# EAGLE design JW24A10L_revE (EAGLE 6.1)
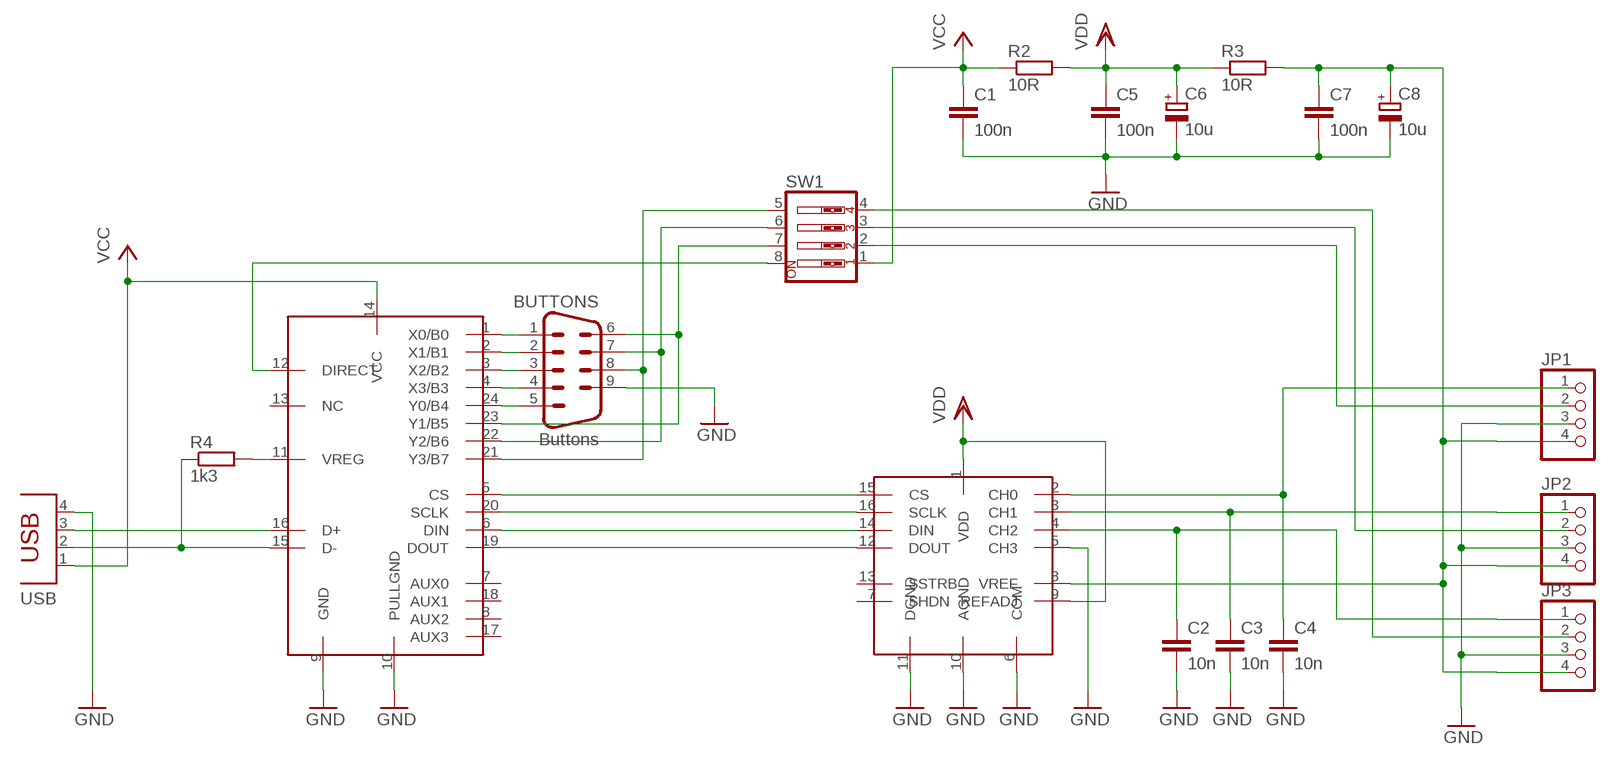
[diagram p0: schematic, sheet 1]

## Parts
BUTTONS  Buttons  M09H  [M09H]
C1  100n  C-EU025-025X050  [C025-025X050]
C2  10n  C-EU025-025X050  [C025-025X050]
C3  10n  C-EU025-025X050  [C025-025X050]
C4  10n  C-EU025-025X050  [C025-025X050]
C5  100n  C-EU025-025X050  [C025-025X050]
C6  10u  CPOL-EUE2-5  [E2-5]
C7  100n  C-EU025-025X050  [C025-025X050]
C8  10u  CPOL-EUE2-5  [E2-5]
JP1  PINHD-1X4  [1X04]
JP2  PINHD-1X4  [1X04]
JP3  PINHD-1X4  [1X04]
R2  10R  R-EU_0207/2V  [0207/2V]
R3  10R  R-EU_0207/2V  [0207/2V]
R4  1k3  R-EU_0207/2V  [0207/2V]
SW1  SW_DIP-4  [EDG-04]
U$1  MAX1249  [DIL16]
U$2  JW24A10L  [DIL24-3]
USB  PN61729  [PN61729]

## Nets
CH0: C4.1 JP1.1 U$1.2(CH0)
CH1: C3.1 JP2.1 U$1.3(CH1)
CH2: C2.1 JP3.1 U$1.4(CH2)
CH+: C7.1 C8.+ JP1.4 JP2.4 JP3.4 R3.2 U$1.8(VREF)
D+: U$2.16(D+) USB.3
D-: R4.1 U$2.15(D-) USB.2
GND: BUTTONS.9 C1.2 C2.2 C3.2 C4.2 C5.2 C6.- C7.2 C8.- JP1.3 JP2.3 JP3.3 U$1.5(CH3) U$1.6(COM) U$1.10(AGND) U$1.11(DGND) U$2.9(GND) U$2.10(PULLGND) USB.4
N$1: U$1.15(CS) U$2.5(CS)
N$2: U$1.16(SCLK) U$2.20(SCLK)
N$3: U$1.14(DIN) U$2.6(DIN)
N$4: U$1.12(DOUT) U$2.19(DOUT)
N$7: BUTTONS.1 U$2.1(X0/B0)
N$9: R4.2 U$2.11(VREG)
N$12: BUTTONS.2 U$2.2(X1/B1)
N$13: BUTTONS.3 U$2.3(X2/B2)
N$14: BUTTONS.4 U$2.4(X3/B3)
N$15: BUTTONS.5 U$2.24(Y0/B4)
N$16: BUTTONS.6 SW1.7 U$2.23(Y1/B5)
N$17: BUTTONS.7 SW1.6 U$2.22(Y2/B6)
N$18: BUTTONS.8 SW1.5 U$2.21(Y3/B7)
N$19: SW1.8 U$2.12(DIRECT)
STECK0: JP1.2 SW1.2
STECK1: JP2.2 SW1.3
STECK2: JP3.2 SW1.4
VCC: C1.1 R2.1 SW1.1 U$2.14(VCC) USB.1
VDD: C5.1 C6.+ R2.2 R3.1 U$1.1(VDD) U$1.9(REFADJ)
Unconnected: U$1.7(SHDN) U$1.13(SSTRB) U$2.7(AUX0) U$2.8(AUX2) U$2.13(NC) U$2.17(AUX3) U$2.18(AUX1)

## Library data of the parts
BUTTONS = con-subd:M09: SUB-D; OC_FARNELL: unknown; OC_NEWARK: unknown
C1-C5 C7 = rcl:C-EU: CAPACITOR, European symbol
C6 C8 = rcl:CPOL-EU: POLARIZED CAPACITOR, European symbol
JP1-JP3 = pinhead:PINHD-1X4: PIN HEADER
R2-R4 = rcl:R-EU_: RESISTOR, European symbol
SW1 = special:SW_DIP-4: DIP SWITCH
U$1 = eigene:MAX1249
U$2 = eigene:JW24A10L
USB = con-berg:PN61729: BERG USB connector; OC_FARNELL: unknown; OC_NEWARK: unknown

## Board
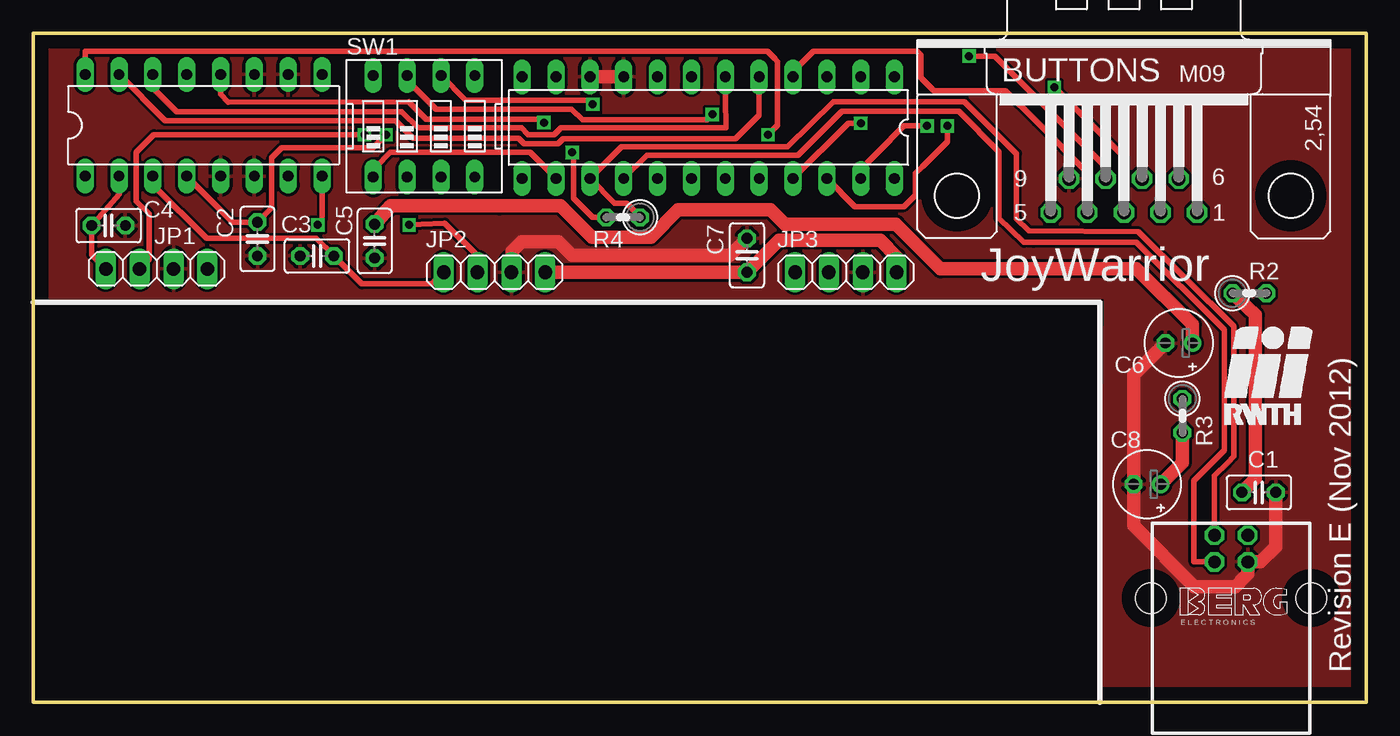
[diagram p1: board, top side]
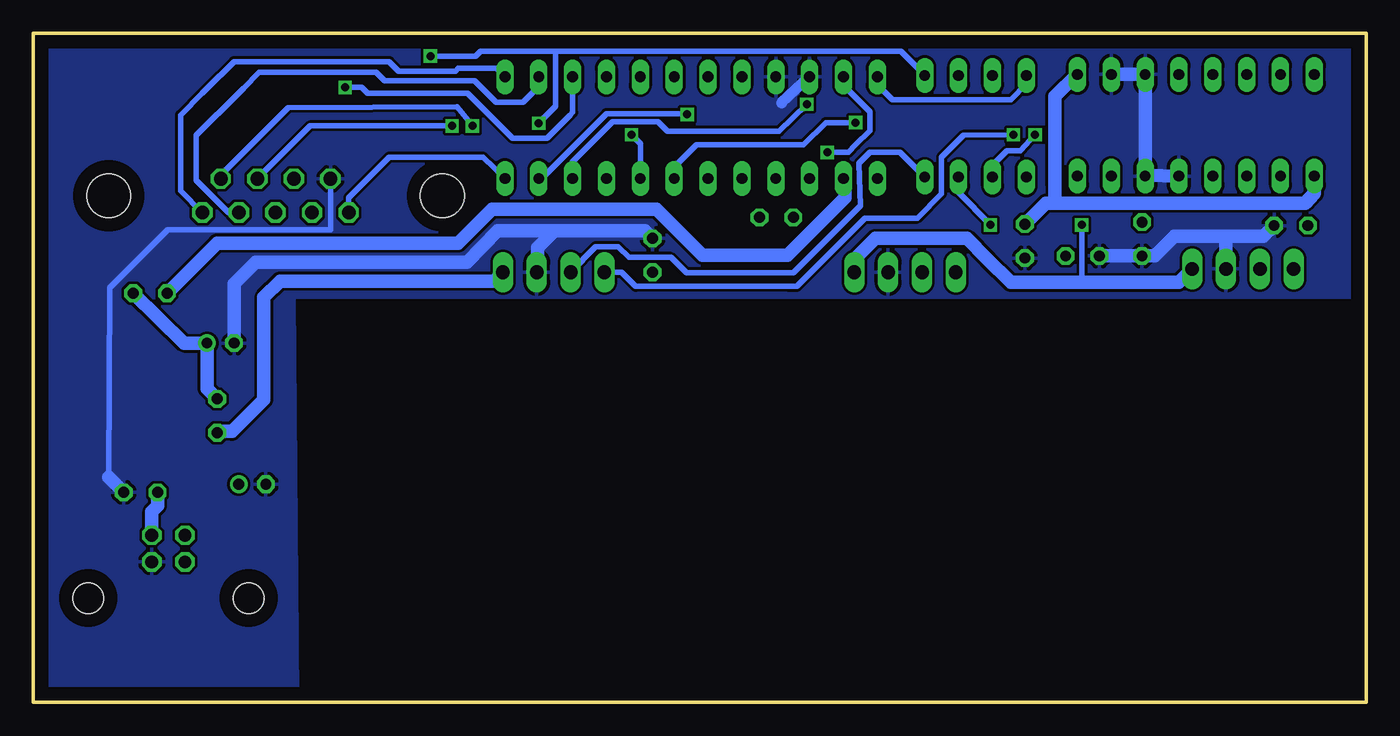
[diagram p2: board, bottom side, seen from below]

Size 100 x 50.18 mm. Coordinates in mm from the lower left corner, seen from the top.
Outline: 100,50.18 0,50.18 0,0 100,0 100,50.18
Copper layers (1*16): Top 0.035mm / dielectric 1.5mm / Bottom 0.035mm
Design rules: minimum track width 10mil, minimum drill 24mil, track to track 8mil, track to pad 8mil, pad to pad 8mil, via to via 8mil, smd to smd 8mil, copper to edge 40mil, drill to drill 8mil, minimum pad ring 10mil, minimum via ring 8mil, stop-mask expansion 4mil, vias tented up to drill 0mil, thermal gap 10mil

### Footprints (pad centres in the part's own frame; a part is rotated, then mirrored left to right if it is on the bottom)
M09H = drill 1.016 octagon: 1 -5.486,1.27; 2 -2.743,1.27; 3 0,1.27; 4 2.743,1.27; 5 5.486,1.27; 6 -4.115,-1.27; 7 -1.372,-1.27; 8 1.372,-1.27; 9 4.115,-1.27 | hole 3.302: 12.522,0; -12.522,0
C025-025X050 = drill 0.813 octagon: 1 -1.27,0; 2 1.27,0
E2-5 = drill 0.813 pad 1.27: + -1.016,0 | drill 0.813 pad 1.27 octagon: - 1.016,0
1X04 = drill 1.016 long: 1 -3.81,0; 2 -1.27,0; 3 1.27,0; 4 3.81,0
0207/2V = drill 0.813 octagon: 1 -1.27,0; 2 1.27,0
EDG-04 = drill 0.813 long: 1 -3.81,-3.81; 2 -1.27,-3.81; 3 1.27,-3.81; 4 3.81,-3.81; 5 3.81,3.81; 6 1.27,3.81; 7 -1.27,3.81; 8 -3.81,3.81
DIL16 = drill 0.813 long: 1 -8.89,-3.81; 2 -6.35,-3.81; 3 -3.81,-3.81; 4 -1.27,-3.81; 5 1.27,-3.81; 6 3.81,-3.81; 7 6.35,-3.81; 8 8.89,-3.81; 9 8.89,3.81; 10 6.35,3.81; 11 3.81,3.81; 12 1.27,3.81; 13 -1.27,3.81; 14 -3.81,3.81; 15 -6.35,3.81; 16 -8.89,3.81
DIL24-3 = drill 0.813 long: 1 -13.97,-3.81; 2 -11.43,-3.81; 3 -8.89,-3.81; 4 -6.35,-3.81; 5 -3.81,-3.81; 6 -1.27,-3.81; 7 1.27,-3.81; 8 3.81,-3.81; 9 6.35,-3.81; 10 8.89,-3.81; 11 11.43,-3.81; 12 13.97,-3.81; 13 13.97,3.81; 14 11.43,3.81; 15 8.89,3.81; 16 6.35,3.81; 17 3.81,3.81; 18 1.27,3.81; 19 -1.27,3.81; 20 -3.81,3.81; 21 -6.35,3.81; 22 -8.89,3.81; 23 -11.43,3.81; 24 -13.97,3.81
PN61729 = drill 0.95 octagon: 1 1.25,4.71; 2 -1.25,4.71; 3 -1.25,2.71; 4 1.25,2.71 | hole 2.3: -6.02,0; 6.02,0

### Placement (x,y rotation side)
BUTTONS  81.83,38 180 top
C1  91.95,15.75 0 top
C2  16.81,34.75 270 top
C3  21.29,33.48 180 top
C4  5.64,35.76 0 top
C5  25.6,34.59 270 top
C6  85.95,26.95 180 top
C7  53.54,33.53 90 top
C8  83.57,16.36 180 top
JP1  9.25,32.51 0 top
JP2  34.59,32.26 0 top
JP3  60.96,32.26 0 top
R2  91.24,30.68 0 top
R3  86.21,21.49 270 top
R4  44.25,36.37 180 top
SW1  29.31,43.21 0 top
U$1  12.78,43.28 0 top
U$2  50.65,43.1 180 top
USB  89.87,7.82 0 top

### Tracks (layer width: path | path; a pad name or v marks a point on that pad's centre or on a via)
CH0
  Top 0.406: U$1.2 6.43,38.12 C4.1 4.37,33.58 JP1.1
CH1
  Top 0.406: JP2.1 29.92,31.39 24.64,31.39 23.06,32.97 C3.1 21.23,34.8 13.01,34.8 8.97,38.84 U$1.3
CH2  (via drill 0.6)
  Top 0.406: U$1.4 14.96,36.02 C2.1 17.88,37.08 17.88,40.84 18.64,41.6 24.23,41.6 25.5,41.6 v26.47,42.57
  Bottom 0.406: v26.47,42.57 30.23,42.52 31.85,40.89 31.85,38.15 33.68,36.32 37.59,36.32 42.72,31.19 43.33,31.19 54.81,31.19 55.88,32.26 JP3.1
CH+  (via drill 0.6)
  Top 0.406: U$1.8 21.67,36.14 v21.34,35.81
  Top 1.016: JP3.4 64.77,33.43 63.55,34.65 55.93,34.65 C7.1 53.49,32.31 53.44,32.31 53.39,32.26 JP2.4 | R3.2 86.21,17.98 C8.+
  Bottom 0.406: v21.34,35.81 21.34,31.75 21.34,31.5
  Bottom 1.016: JP3.4 65.43,31.6 76.15,31.6 81.48,31.6 82.7,30.38 82.7,22.71 85.09,20.32 86.11,20.32 R3.2 | JP2.4 38.41,33.22 36.83,34.8 29.97,34.8 28.45,33.27 26.67,31.5 21.34,31.5 14.07,31.5 JP1.4
D+
  Top 0.406: USB.3 87.07,10.53 87.07,16.61 89.36,18.9 89.36,27.94 82.75,34.49 75.03,34.49 74.32,34.49 72.44,36.32 72.44,41.3 69.44,44.35 60.66,44.35 57.35,41.05 46.79,41.05 46.05,41.05 U$2.16
D-
  Top 0.406: USB.2 88.61,16.99 89.61,17.98 90.07,18.44 90.07,28.19 82.91,35.31 74.68,35.36 73.76,36.27 73.76,41.15 69.85,45.06 60.05,45.06 56.59,41.66 47.14,41.66 44.12,41.66 U$2.15 43.61,37.44 44.5,37.44 45.52,36.42 R4.1
GND
  Top 1.016: C1.2 93.22,11.68 92.07,10.53 91.26,10.53 USB.4 91.11,9.63 90.93,9.45 90.17,8.69 87.12,8.69 82.55,13.26 C8.- 82.55,24.56 C6.- | U$2.9 U$2.10 | C7.2 52.27,33.53 41.45,33.53 40.44,33.53 39.42,34.54 38.1,34.54 36.63,34.54 35.92,33.83 35.92,32.46 35.87,32.41 JP2.3
  Bottom 0.406: BUTTONS.9 77.71,35.46 78.84,35.46 89.92,35.46 94.28,31.09 94.34,16.87
  Bottom 0.813: U$2.10 43.87,44.96
  Bottom 1.016: U$1.5 16.46,39.52 | 16.46,39.52 U$1.6 | 16.46,39.52 16.59,39.65 16.59,41.81 U$1.11 U$1.10 | C3.2 C2.2 15.85,33.48 14.38,34.95 10.52,34.95 | C7.2 54.1,35.36 59.08,35.36 60.91,35.36 | 60.91,35.36 62.18,34.09 62.18,32.31 JP3.3 | 60.91,35.36 65.18,35.36 67.46,33.02 75.74,33.02 81.94,33.02 83.31,33.02 84.53,31.8 84.94,31.39 C6.- | 94.34,16.87 C1.2 | 35.92,32.87 35.92,32.31 JP2.3 | 10.52,34.95 7.72,34.95 C4.2 | JP1.3 10.52,34.95
  pour Bottom: 0.25,49.78 0.25,30.38 80.42,30.38 80.16,0.25 99.77,0.25 99.77,49.78
  pour Top: 0.25,49.78 0.25,30.38 80.42,30.38 80.16,0.25 99.77,0.25 99.77,49.78
N$1
  Top 0.406: U$1.15 9.88,43.64 27.18,43.64 28.5,42.32 36.42,42.32 36.83,41.91 39.37,41.91 39.73,42.27 52.68,42.27 53.7,43.28 54.46,44.04 U$2.5
N$2  (via drill 0.6)
  Top 0.406: U$1.16 3.89,47.93 3.91,48.82 44.73,48.82 52.38,48.82 55.07,48.82 55.63,48.26 55.83,48.06 55.83,43.28 v55.12,42.57
  Bottom 0.406: U$2.20 54.46,41.91 v55.12,42.57
N$3
  Top 0.406: U$1.14 8.97,46.1 10.77,44.3 27.64,44.3 28.85,43.08 36.63,43.08 37.13,42.57 39.06,42.57 39.47,42.98 39.57,43.08 51.97,43.08 51.92,45.26 U$2.6
N$4  (via drill 0.6)
  Top 0.406: U$1.12 14.05,45.59 14.63,45.01 28.14,45.06 29.46,43.74 38.25,43.74 v38.3,43.48
  Bottom 0.406: v38.3,43.48 40.54,43.48 42.22,41.81 50.24,41.81 51.92,40.13 U$2.19
N$7
  Bottom 0.406: U$2.1 65.25,47.55 68.12,47.55 68.33,47.35 72.59,47.35 73.3,48.06 78.33,48.06 84.94,48.06 87.02,45.97 87.31,45.68 88.95,44.04 88.95,43.13 88.95,38.37 BUTTONS.1
N$9  (via drill 0.6)
  Top 0.406: v40.44,41.25 40.69,41.2 40.54,41.05 40.54,37.8 41.96,36.37 R4.2
  Bottom 0.406: U$2.11 39.22,46.28 37.24,44.3 37.24,42.88 38.3,41.81 38.86,41.25 v40.44,41.25
N$12
  Bottom 0.406: U$2.2 62.08,46.18 63.25,45.01 65.28,45.01 66.9,46.63 73.66,46.63 74.27,47.24 83.06,47.24 84.23,46.08 84.57,45.73 87.78,42.52 87.78,39.17 85.34,36.73 BUTTONS.2
N$13  (via drill 0.6)
  Top 0.406: BUTTONS.3 81.89,36.79 81.89,40.84 v76.61,46.13
  Bottom 0.406: U$2.3 59.54,44.25 59.74,44.04 61.47,42.32 64.06,42.32 67.41,45.67 74.93,45.67 75.39,46.13 v76.61,46.13
N$14
  Top 0.406: BUTTONS.4 79.08,39.74 75.29,43.54 72.95,45.87 67.56,45.87 66.6,46.84 66.6,48.51 66.29,48.82 58.52,48.82 57,47.3 U$2.4
N$15
  Bottom 0.406: U$2.24 66.27,40.89 73.3,40.89 76.34,37.86 BUTTONS.5
N$16  (via drill 0.6)
  Top 0.406: U$2.23 62.08,39.98 63.3,41.2 65.33,43.23 v67.06,43.23 | v50.95,44.09 50.55,43.69 41.2,43.69 40.39,44.5 38.3,44.5 30.21,44.5 28.04,46.67 SW1.7
  Bottom 0.406: v67.06,43.23 68.22,44.65 80.87,44.6 85.94,39.53 BUTTONS.6 | v50.95,44.09 51,44.09 51.31,44.15 57,44.15 61.85,39.29 U$2.23
N$17  (via drill 0.6)
  Top 0.406: U$2.22 61.65,37.19 65.33,37.19 66.19,38.05 66.19,39.62 66.19,39.67 66.7,40.18 68.58,42.06 v68.58,43.23 | v41.96,44.86 41.81,45.06 41.71,45.16 39.67,45.16 32.44,45.16 SW1.6
  Bottom 0.406: v68.58,43.23 79.24,43.23 BUTTONS.7 | v41.96,44.86 44.04,42.82 44.25,42.82 52.43,42.82 53.14,43.54 56.54,43.54 59.54,40.54 U$2.22
N$18  (via drill 0.6)
  Top 0.406: U$2.21 61.14,43.43 v62.08,43.43 | v70.21,48.46 71.26,48.46 72.14,48.46 79.86,40.74 80.45,40.14 BUTTONS.8
  Bottom 0.406: SW1.5 34.92,48.82 37.08,48.82 60.15,48.82 60.81,48.82 | 60.81,48.82 60.86,48.82 60.81,48.82 | 60.81,48.82 66.45,48.82 66.8,48.46 v70.21,48.46 | v62.08,43.43 60.81,44.7 60.81,48.82
N$19
  Bottom 0.406: SW1.8 25.5,46.38 26.67,45.21 35.56,45.21 36.32,45.97 36.68,46.33 U$2.12
STECK0  (via drill 0.6)
  Top 0.406: JP1.2 8.69,33.22 8.69,36.63 7.72,37.59 7.72,41.25 9.04,42.57 23.32,42.57 v24.84,42.57 | v24.84,42.57 25.04,42.57 v24.84,42.57
  Bottom 0.406: v24.84,42.57 25.96,41.35 26.31,41.35 26.98,41.35 28.04,40.28 SW1.2
STECK1  (via drill 0.6)
  Top 0.406: JP2.2 33.33,33.48 30.86,35.94 | 30.86,35.94 v28.19,35.81 30.86,35.94
  Bottom 0.406: SW1.3 30.58,38.25 v28.19,35.81
STECK2
  Bottom 0.406: 52.93,33.38 52.98,33.38 | 52.98,33.38 55.32,33.38 56.13,34.19 57.81,34.19 JP3.2 | SW1.4 34.98,41.25 37.24,41.25 38.05,40.44 37.95,37.24 42.98,32.21 51,32.21 52.17,33.38 52.98,33.38
VCC
  Top 0.406: U$2.14 37.26,41.25 26.77,41.25 25.7,40.18 25.5,39.98 SW1.1
  Top 1.016: C1.1 91.69,16.76 91.69,27.48 91.69,29.06 R2.1
  Bottom 1.016: USB.1 91.11,14.29 90.68,14.73 C1.1 | R2.1 86.21,34.44 83.52,34.44 68.12,34.44 65.58,36.98 65.28,36.98 53.44,36.98 53.24,36.98 49.78,33.53 43.43,33.53 39.12,37.85 39.12,39.19 U$2.14
VDD
  Top 1.016: C5.1 26.82,37.24 34.95,37.24 39.57,37.24 39.98,36.83 40.49,36.32 41.91,34.9 46.33,34.9 48.36,36.93 55.32,36.93 56.39,35.87 64.72,35.87 68.07,32.51 82.75,32.51 86.97,28.35 C6.+
  Bottom 1.016: U$1.9 23.37,45.44 23.37,38.86 23.37,37.44 | U$1.1 3.89,38.18 4.57,37.44 22.45,37.44 23.37,37.44 | R3.1 86.97,23.52 C6.+ 88.67,26.95 R2.2 | 23.37,37.44 24.03,37.44 C5.1

### Text on the board
tPlace: JoyWarrior | Revision E (Nov 2012)